# Altium schematic sheet GateDriver.SchDoc
size A4; Address1: ECE Department; Address2: University of Canterbury; Address3: Christchurch 8041; Address4: New Zealand; Revision: 1
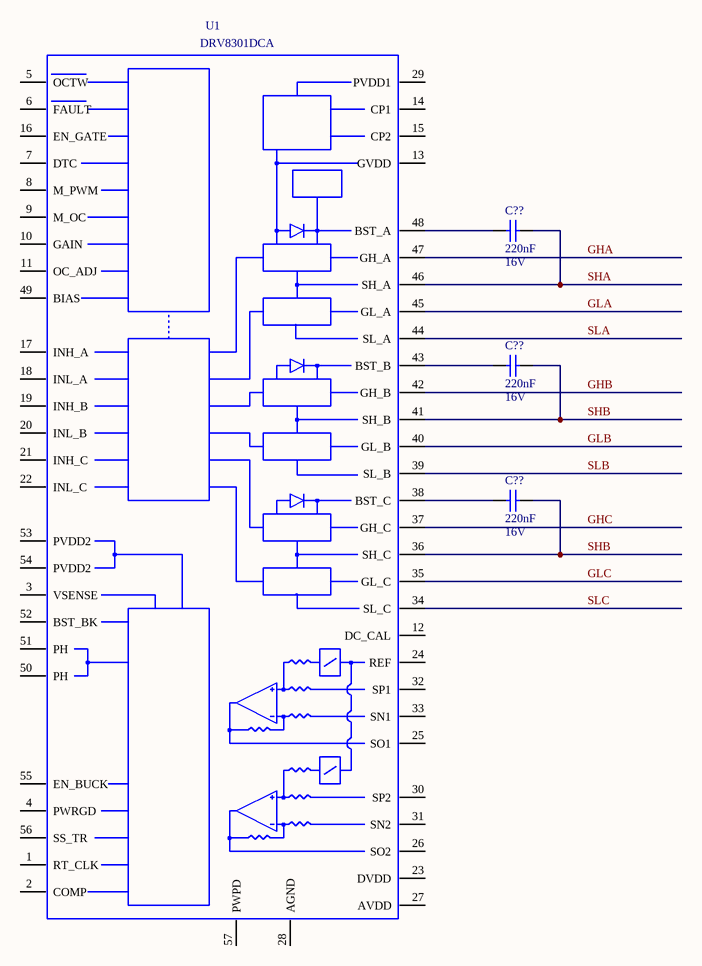
[diagram p0: GateDriver.SchDoc]

## Parts
(Parts that share a designator on the sheet are numbered #1, #2 ... from top to bottom, then left to right.)
C??#1  MoV: 16V  [CAPC1608L]  (hidden comment: 220nF)
C??#2  MoV: 16V  [CAPC1608L]  (hidden comment: 220nF)
C??#3  MoV: 16V  [CAPC1608L]  (hidden comment: 220nF)
U1  DRV8301DCA  [DCA_56P]

## Nets
GHA: U1.47(GH_A)
GHB: U1.42(GH_B)
GHC: U1.37(GH_C)
GLA: U1.45(GL_A)
GLB: U1.40(GL_B)
GLC: U1.35(GL_C)
SHA: C??#1.2 U1.46(SH_A)
SHB: C??#2.2 C??#3.2 U1.36(SH_C) U1.41(SH_B)
SLA: U1.44(SL_A)
SLB: U1.39(SL_B)
SLC: U1.34(SL_C)
NetC??#1_1: C??#1.1 U1.48(BST_A)
NetC??#2_1: C??#2.1 U1.43(BST_B)
NetC??#3_1: C??#3.1 U1.38(BST_C)

Not connected (* = marked no-connect by the designer): U1 1(RT_CLK) 2(COMP) 3(VSENSE) 4(PWRGD) 5(OCTW) 6(FAULT) 7(DTC) 8(M_PWM) 9(M_OC) 10(GAIN) 11(OC_ADJ) 12(DC_CAL) 13(GVDD) 14(CP1) 15(CP2) 16(EN_GATE) 17(INH_A) 18(INL_A) 19(INH_B) 20(INL_B) 21(INH_C) 22(INL_C) 23(DVDD) 24(REF) 25(SO1) 26(SO2) 27(AVDD) 28(AGND) 29(PVDD1) 30(SP2) 31(SN2) 32(SP1) 33(SN1) 49(BIAS) 50(PH) 51(PH) 52(BST_BK) 53(PVDD2) 54(PVDD2) 55(EN_BUCK) 56(SS_TR) 57(PWPD)

## Notes on the sheet
- Title
- Drawn by:
- Date:
- Time:
- Revision:
- Sheet
- of
- File:

## Library data of the parts
C??#1-C??#3 = CC_220nF_0603: CAP CER 220nF Y5V -20% +80% 16V 0603; PackageReference: 0603; Code_IPC: 1608 [0603]; Verify: *; Supplier: ECE Dept; Storage Location: PCB Assembly WS; Value: 220nF
U1 = DRV8302DCA_ERIC: IC, 3 Phase Pre-Driver with Dual Current Shunt Amplifiers and Buck Regulator-Hardware Controlled; Manufacturer: Texas Instruments; Area: 154.44 mm; Vendor: Supplied; Value: DRV8301DCA; ModifyDate: 05/02/2012 07:50:13; PartNumber: DRV8301DCA; Size: HTSSOP; PCB DECAL: DCA_56P; Vendor Part #: Supplied